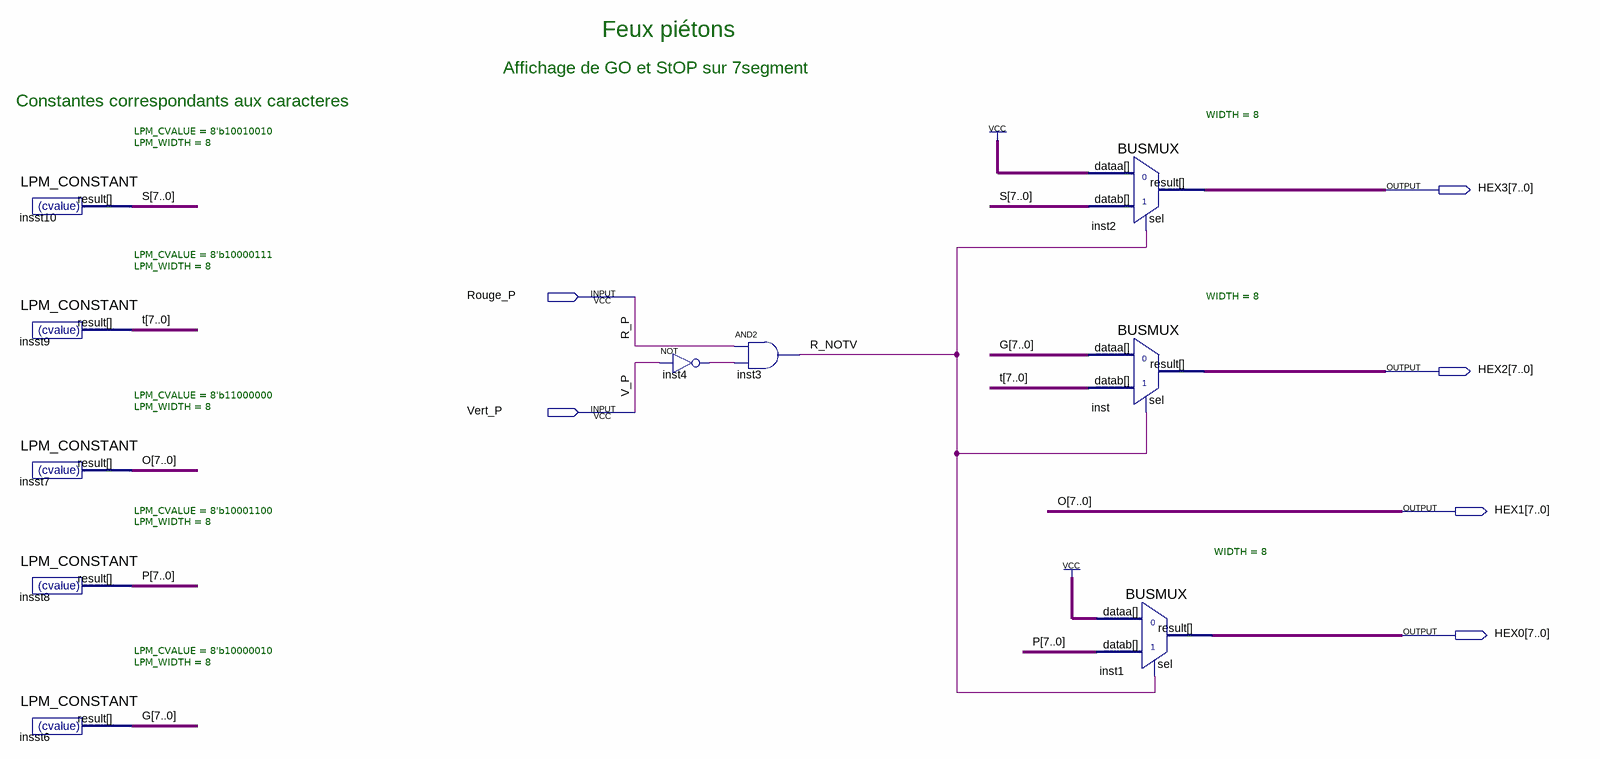
[diagram p0: schematic sheet]
// Quartus schematic Affichage_pietons.bdf as structural Verilog: 10 symbols, 6 pins
module Affichage_pietons (
  input  Rouge_P,
  input  Vert_P,
  output [7:0] HEX3,
  output [7:0] HEX2,
  output [7:0] HEX1,
  output [7:0] HEX0
);

  wire inst4_out, R_NOTV;
  wire [7:0] G, P, S, t;

  LPM_CONSTANT #(.LPM_CVALUE(8'b10010010), .LPM_WIDTH(8)) insst10 (.result(S));
  LPM_CONSTANT #(.LPM_CVALUE(8'b10000111), .LPM_WIDTH(8)) insst9 (.result(t));
  LPM_CONSTANT #(.LPM_CVALUE(8'b11000000), .LPM_WIDTH(8)) insst7 (.result(HEX1));
  LPM_CONSTANT #(.LPM_CVALUE(8'b10001100), .LPM_WIDTH(8)) insst8 (.result(P));
  LPM_CONSTANT #(.LPM_CVALUE(8'b10000010), .LPM_WIDTH(8)) insst6 (.result(G));
  not inst4 (inst4_out, Vert_P);
  and inst3 (R_NOTV, Rouge_P, inst4_out);
  BUSMUX #(.WIDTH(8)) inst2 (.datab(S), .sel(R_NOTV), .dataa({8{1'b1}}), .result(HEX3));
  BUSMUX #(.WIDTH(8)) inst (.datab(t), .sel(R_NOTV), .dataa(G), .result(HEX2));
  BUSMUX #(.WIDTH(8)) inst1 (.datab(P), .sel(R_NOTV), .dataa({8{1'b1}}), .result(HEX0));

  // Other names for the same wires on the sheet: O[7:0] = HEX1; R_P = Rouge_P; V_P = Vert_P

  // Notes on the sheet:
  //   Feux piétons  
  //   Affichage de GO et StOP sur 7segment        
  //   Constantes correspondants aux caracteres        
endmodule
